# EAGLE design d0reader (EAGLE 9.5.2)
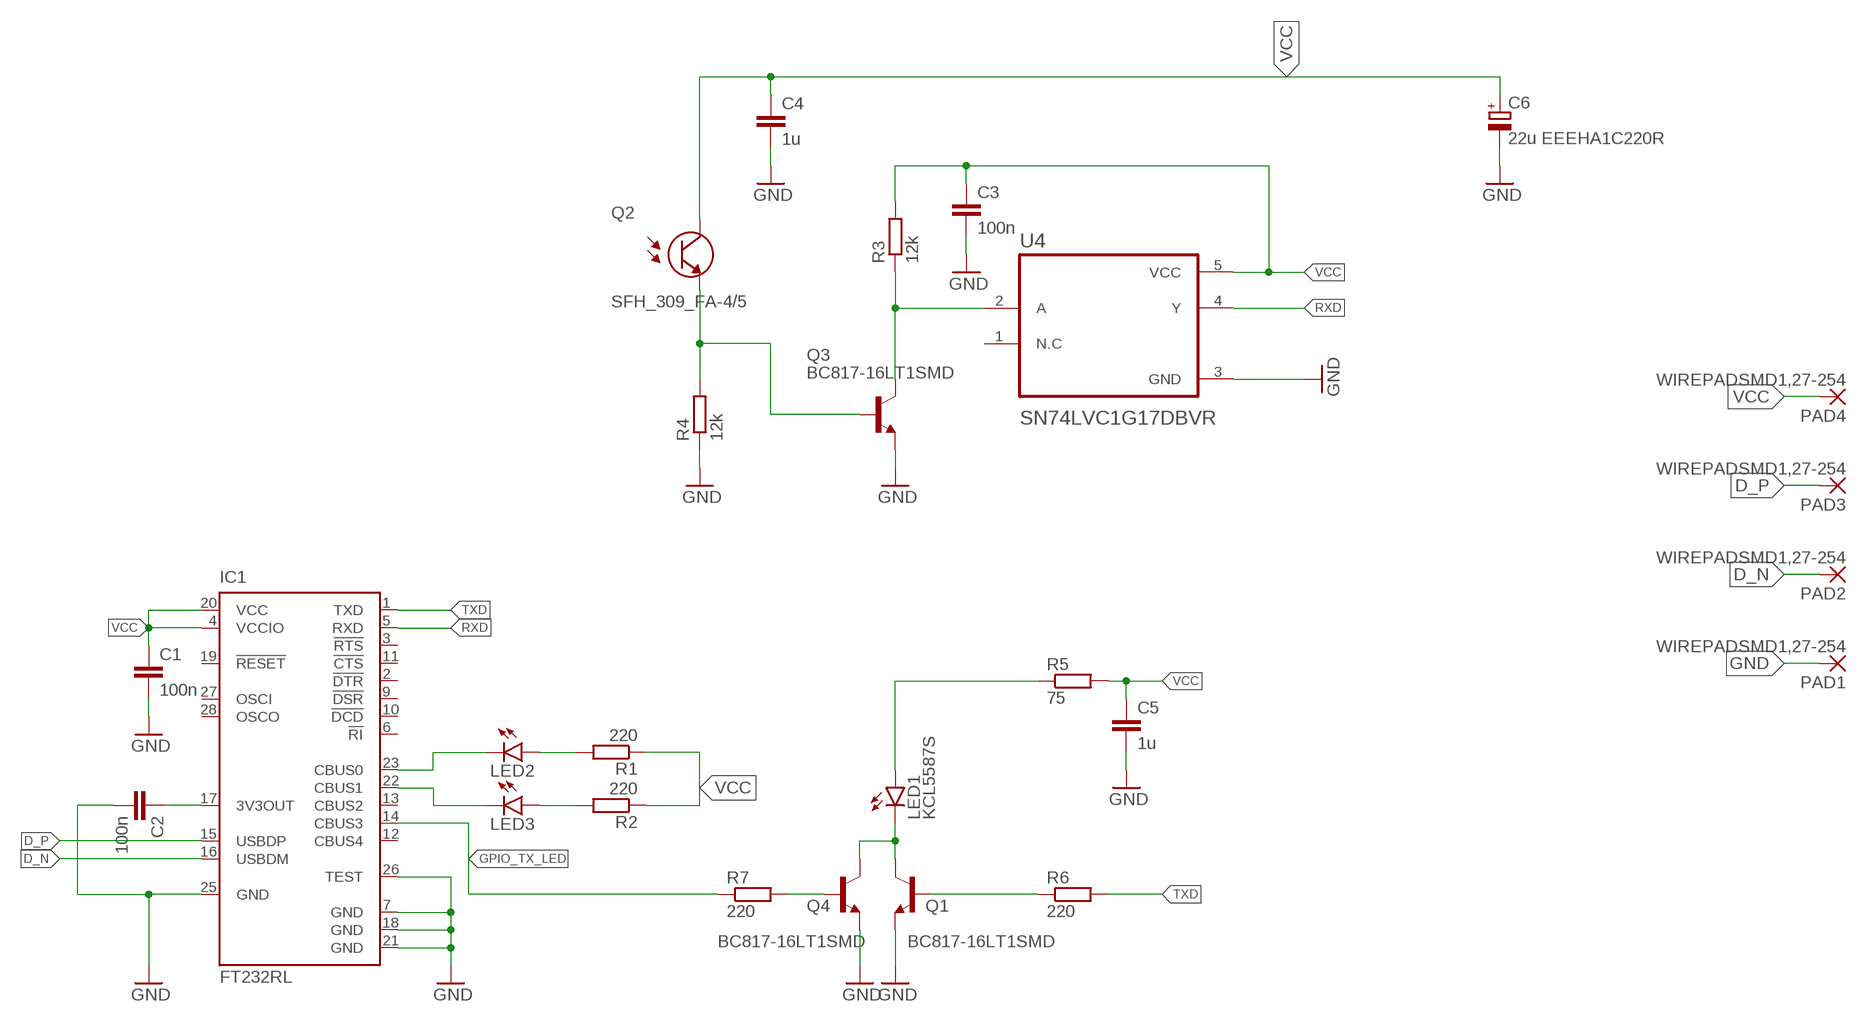
[diagram p0: schematic, sheet 1]

## Parts
C1  100n  C-EUC0805  [C0805]
C2  100n  C-EUC0805  [C0805]
C3  100n  C-EUC0805  [C0805]
C4  1u  C-EUC0805  [C0805]
C5  1u  C-EUC0805  [C0805]
C6  22u EEEHA1C220R  CPOL-EU153CLV-0505  [153CLV-0505]
IC1  FT232RL  [SSOP28]
LED1  KCL5587S  LED5MM  [LED5MM]
LED2  LEDCHIPLED_0805  [CHIPLED_0805]
LED3  LEDCHIPLED_0805  [CHIPLED_0805]
PAD1  WIREPADSMD1,27-254  [SMD1,27-2,54]
PAD2  WIREPADSMD1,27-254  [SMD1,27-2,54]
PAD3  WIREPADSMD1,27-254  [SMD1,27-2,54]
PAD4  WIREPADSMD1,27-254  [SMD1,27-2,54]
Q1  BC817-16LT1SMD  [SOT23-BEC]
Q2  SFH_309_FA-4/5  [XDCR_SFH_309_FA-4/5]
Q3  BC817-16LT1SMD  [SOT23-BEC]
Q4  BC817-16LT1SMD  [SOT23-BEC]
R1  220  R-EU_R0805  [R0805]
R2  220  R-EU_R0805  [R0805]
R3  12k  R-EU_R0805  [R0805]
R4  12k  R-EU_R0805  [R0805]
R5  75  R-EU_R0805  [R0805]
R6  220  R-EU_R0805  [R0805]
R7  220  R-EU_R0805  [R0805]
U4  SN74LVC1G17DBVR  [SOT95P280X145-5N]

## Nets
D_N: IC1.16(USBDM) PAD2.1(P)
D_P: IC1.15(USBDP) PAD3.1(P)
GND: C1.2 C2.2 C3.2 C4.2 C5.2 C6.- IC1.7(GND) IC1.18(GND) IC1.21(GND) IC1.25(GND) IC1.26(TEST) PAD1.1(P) Q1.E Q3.E Q4.E R4.1 U4.3(GND)
GPIO_TX_LED: IC1.14(CBUS3) R7.1
INPUTA: Q3.C R3.1 U4.2(A)
N$9: LED2.A R1.2
N$10: LED3.A R2.2
N$14: C2.1 IC1.17(3V3OUT)
OPTO_RX: Q2.1(E) Q3.B R4.2
RXD: IC1.5(RXD) U4.4(Y)
RXLED: IC1.22(CBUS1) LED3.C
TX_LED_Q1: Q1.B R6.1
TX_LED_Q4: Q4.B R7.2
TXD: IC1.1(TXD) R6.2
TXLED: IC1.23(CBUS0) LED2.C
TXLEDGND: LED1.K(C) Q1.C Q4.C
TXLEDVCC: LED1.A R5.1
VCC: C1.1 C3.1 C4.1 C5.1 C6.+ IC1.4(VCCIO) IC1.20(VCC) PAD4.1(P) Q2.2(C) R1.1 R2.1 R3.2 R5.2 U4.5(VCC)
Unconnected: IC1.2(!DTR) IC1.3(!RTS) IC1.6(!RI) IC1.9(!DSR) IC1.10(!DCD) IC1.11(!CTS) IC1.12(CBUS4) IC1.13(CBUS2) IC1.19(!RESET) IC1.27(OSCI) IC1.28(OSCO) U4.1(N.C)

## Library data of the parts
C1-C5 = rcl:C-EU: CAPACITOR, European symbol; SPICEPREFIX: C
C6 = rcl:CPOL-EU: POLARIZED CAPACITOR, European symbol; SPICEPREFIX: C
IC1 = ftdichip:FT232R: Source: http://www.ftdichip.com/Documents/DataSheets/DS_FT232R_v104.pdf; MPN: FT232RL; OC_FARNELL: 1146032; OC_NEWARK: 91K9918
LED1-LED3 = led:LED: LED OSRAM: - CHIPLED LG R971, LG N971, LY N971, LG Q971, LY Q971, LO R971, LY R971 LH N974, LH R974 LS Q976, LO Q976, LY Q976 LO Q996 - Hyper CHIPLED LW Q18S LB Q993, LB Q99A, LB R99A - SideLED LS A670, LO A670, LY A670, LG A670, LP A670 LB A673, LV A673, LT A673, LW A673 LH A674 LY A675 LS A676, LA A676, LO A676, LY A676, LW A676 LS A679, LY A679, LG A679 - Hyper Micro SIDELED® LS Y876, LA Y876, LO Y876, LY Y876 LT Y87S - SmartLED LW L88C, LW L88S LB L89C, LB L89S, LG L890 LS L89K, LO L89K, LY L89K LS L896, LA L896, LO L896, LY L896 - TOPLED LS T670, LO T670, LY T670, LG T670, LP T670 LSG T670, LSP T670, LSY T670, LOP T670, LYG T670 LG T671, LOG T671, LSG T671 LB T673, LV T673, LT T673, LW T673 LH T674 LS T676, LA T676, LO T676, LY T676, LB T676, LH T676, LSB T676, LW T676 LB T67C, LV T67C, LT T67C, LS T67K, LO T67K, LY T67K, LW E67C LS E67B, LA E67B, LO E67B, LY E67B, LB E67C, LV E67C, LT E67C LW T67C LS T679, LY T679, LG T679 LS T770, LO T770, LY T770, LG T770, LP T770 LB T773, LV T773, LT T773, LW T773 LH T774 LS E675, LA E675, LY E675, LS T675 LS T776, LA T776, LO T776, LY T776, LB T776 LHGB T686 LT T68C, LB T68C - Hyper Mini TOPLED® LB M676 - Mini TOPLED Santana® LG M470 LS M47K, LO M47K, LY M47K Source: http://www.osram.convergy.de LUXEON: - LUMILED® LXK2-PW12-R00, LXK2-PW12-S00, LXK2-PW14-U00, LXK2-PW14-V00 LXK2-PM12-R00, LXK2-PM12-S00, LXK2-PM14-U00 LXK2-PE12-Q00, LXK2-PE12-R00, LXK2-PE12-S00, LXK2-PE14-T00, LXK2-PE14-U00 LXK2-PB12-K00, LXK2-PB12-L00, LXK2-PB12-M00, LXK2-PB14-N00, LXK2-PB14-P00, LXK2-PB14-Q00 LXK2-PR12-L00, LXK2-PR12-M00, LXK2-PR14-Q00, LXK2-PR14-R00 LXK2-PD12-Q00, LXK2-PD12-R00, LXK2-PD12-S00 LXK2-PH12-R00, LXK2-PH12-S00 LXK2-PL12-P00, LXK2-PL12-Q00, LXK2-PL12-R00 Source: www.luxeon.com KINGBRIGHT: KA-3528ASYC Source: www.kingbright.com
PAD1-PAD4 = wirepad:WIREPAD: Wire PAD connect wire on PCB
Q1 Q3 Q4 = transistor-npn:BC817*: NPN Transistor
Q2 = SFH_309_FA-4_5:SFH_309_FA-4/5: Phototransistor IR Chip Silicon 900nm 2-Pin T-1 Check prices <https://pricing.snapeda.com/parts/SFH%20309%20FA-4/5/OSRAM%20Opto/view-part?ref=eda>; AVAILABILITY: In Stock; DESCRIPTION: Phototransistors 900nm Top View Radial, T-1 Lens; MF: OSRAM Opto; MP: SFH 309 FA-4/5; PACKAGE: Radial OSRAM Opto; PRICE: None
R1-R7 = rcl:R-EU_: RESISTOR, European symbol; SPICEPREFIX: R
U4 = SN74LVC1G17DBVR:SN74LVC1G17DBVR: Check prices <https://pricing.snapeda.com/parts/SN74LVC1G17DBVR/Texas%20Instruments/view-part?ref=eda>; AVAILABILITY: In Stock; DESCRIPTION: Single Schmitt-Trigger Buffer 5-SOT-23 -40 to 125; MF: Texas Instruments; MP: SN74LVC1G17DBVR; PACKAGE: SOT-23-5 Texas Instruments; PRICE: None; PURCHASE-URL: https://pricing.snapeda.com/search/part/SN74LVC1G17DBVR/?ref=eda

## Board
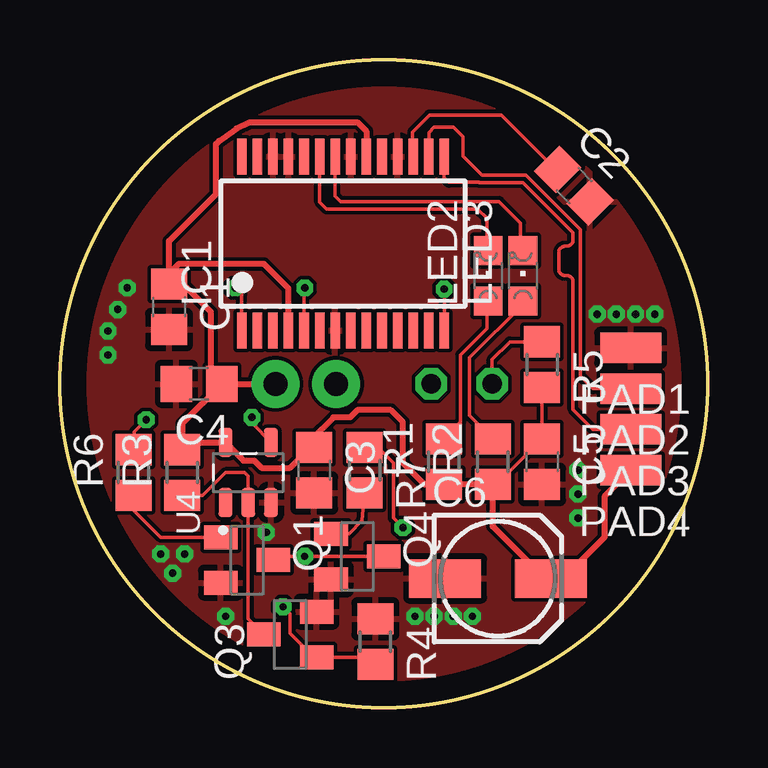
[diagram p1: board, top side]
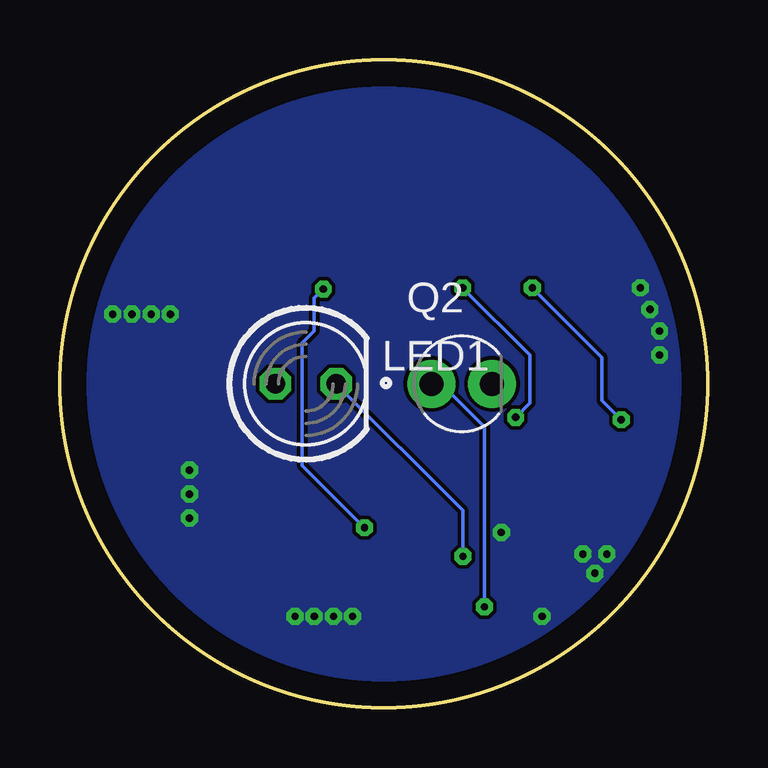
[diagram p2: board, bottom side, seen from below]

Size 27 x 27 mm. Coordinates in mm from the lower left corner, seen from the top.
Outline: circle at 13.5,13.5 radius 13.5
Copper layers (1*16): Top 0.035mm / dielectric 1.5mm / Bottom 0.035mm
Design rules "mme": minimum track width 6mil, minimum drill 0.3mm, track to track 6mil, track to pad 8mil, pad to pad 8mil, via to via 8mil, smd to smd 8mil, copper to edge 40mil, drill to drill 8mil, minimum pad ring 10mil, minimum via ring 8mil, stop-mask expansion 4mil, vias tented up to drill 0mil, thermal gap 10mil

### Footprints (pad centres in the part's own frame; a part is rotated, then mirrored left to right if it is on the bottom)
C0805 = smd 1.3 x 1.5: 1 -0.95,0; 2 0.95,0
153CLV-0505 = smd 3 x 1.6: + 2.2,0; - -2.2,0
SSOP28 = smd 0.4 x 1.5: 1 -4.225,-3.625; 2 -3.575,-3.625; 3 -2.925,-3.625; 4 -2.275,-3.625; 5 -1.625,-3.625; 6 -0.975,-3.625; 7 -0.325,-3.625; 8 0.325,-3.625; 9 0.975,-3.625; 10 1.625,-3.625; 11 2.275,-3.625; 12 2.925,-3.625; 13 3.575,-3.625; 14 4.225,-3.625; 15 4.225,3.625; 16 3.575,3.625; 17 2.925,3.625; 18 2.275,3.625; 19 1.625,3.625; 20 0.975,3.625; 21 0.325,3.625; 22 -0.325,3.625; 23 -0.975,3.625; 24 -1.625,3.625; 25 -2.275,3.625; 26 -2.925,3.625; 27 -3.575,3.625; 28 -4.225,3.625
LED5MM = drill 0.813 octagon: A -1.27,0; K 1.27,0
CHIPLED_0805 = smd 1.2 x 1.2: A 0,-1.05; C 0,1.05
SMD1,27-2,54 = smd 1.27 x 2.54: 1 0,0
SOT23-BEC = smd 1 x 1.4: B -0.95,-1.1; C 0,1.1; E 0.95,-1.1
XDCR_SFH_309_FA-4/5 = drill 1 pad 2: 1 -1.27,0; 2 1.27,0
R0805 = smd 1.3 x 1.5: 1 -0.95,0; 2 0.95,0
SOT95P280X145-5N = smd 1.21 x 0.59: 1 -1.255,0.95; 2 -1.255,0; 3 -1.255,-0.95; 4 1.255,-0.95; 5 1.255,0.95

### Placement (x,y rotation side)
C1  4.55,16.71 270 top
C2  21.43,21.76 315 top
C3  10.6,9.9 270 top
C4  5.8,13.5 180 top
C5  20.1,10.25 270 top
C6  18.26,5.38 0 top
IC1  11.8,19.34 0 top
LED1  16.75,13.5 0 bottom
LED2  17.85,18 0 top
LED3  19.3,18 0 top
PAD1  23.8,15 90 top
PAD2  23.8,13.3 90 top
PAD3  23.8,11.6 90 top
PAD4  23.8,9.9 90 top
Q1  7.8,6.15 270 top
Q2  10.25,13.5 0 bottom
Q3  9.6,3.05 90 top
Q4  12.4,6.3 270 top
R1  16,10.25 90 top
R2  18.05,10.25 90 top
R3  5.1,9.8 90 top
R4  13.15,2.75 270 top
R5  20.1,14.3 270 top
R6  3.07,9.8 90 top
R7  12.7,9.9 270 top
U4  7.85,9.8 90 top

### Tracks (layer width: path | path; a pad name or v marks a point on that pad's centre or on a via)
D_N
  Top 0.152: PAD2.1 22.23,13.3 21.7,13.82 21.7,19.93 19.43,22.2 17.6,22.2 16.8,23 16.8,23.8 16.4,24.2 15.6,24.2 15.38,23.98 IC1.16
D_P
  Top 0.152: PAD3.1 22.23,11.6 21.39,12.43 21.39,17.75 arc90 21.13,18.01 21.06,18.01 arc-90 20.79,18.28 20.79,18.97 arc-90 21.06,19.23 21.13,19.23 arc90 21.39,19.5 21.39,19.8 19.3,21.89 17.47,21.89 17.47,21.9 16.2,21.9 16,22.1 16,22.94 IC1.15
GND  (via drill 0.3)
  other vias: 24.8,16.4 24,16.4 23.2,16.4 22.4,16.4 17.2,3.8 16.4,3.8 15.6,3.8 14.8,3.8 21.6,9.9 21.6,8.9 21.6,7.9 8.6,7.3 4.2,6.4 5.2,6.4 4.7,5.6 6.9,3.8 2.8,17.5 2.4,16.6 2,15.7 2,14.7
  pour Bottom: 0,0 26.1,0 arc90 27.1,1 27.1,26.8 arc90 26.7,27.2 6.5,27.2 1,27.2 arc90 0,26.2
  pour Top: 0,0 0,26.1 arc-90 1,27.1 26.8,27.1 arc-90 27.2,26.7 27.2,6.5 27.2,1 arc-90 26.2,0
GPIO_TX_LED  (via drill 0.3)
  Top 0.152: IC1.14 v16.02,17.45 | v14.3,7.5 13.9,7.9 13.9,10.2 13.25,10.85 R7.1
  Bottom 0.152: v16.02,17.45 16.4,17.07 16.4,15.7 16.9,15.2 16.9,10.1 v14.3,7.5
INPUTA
  Top 0.152: R3.1 5.95,8.85 6.9,9.8 7.7,9.8 7.85,9.65 U4.2 7.85,3.7 Q3.C
N$9
  Top 0.152: LED2.A 17.8,16.9 17.8,15.8 16.7,14.7 16.7,11.9 R1.2
N$10
  Top 0.152: R2.2 17.08,12.17 17.08,14.59 19.3,16.8 LED3.A
N$14
  Top 0.152: C2.1 20.67,22.43 18.4,24.7 15.4,24.7 14.7,24 14.7,22.99 IC1.17
OPTO_RX  (via drill 0.3)
  Top 0.152: R4.2 12.85,2.1 Q3.B 10.6,2.1 9.6,3.1 9.6,3.9 v9.3,4.2
  Bottom 0.152: Q2.1 11.1,13.5 9.3,11.71 v9.3,4.2
RXD  (via drill 0.3)
  Top 0.152: IC1.5 10.18,17.47 v10.21,17.5 | v8,12.1 8,11.86 U4.4
  Bottom 0.152: v10.21,17.5 7.4,14.69 7.4,12.7 v8,12.1
RXLED
  Top 0.152: LED3.C 19.2,19.15 19.2,20.2 18.3,21.09 11.71,21.09 11.47,21.32 IC1.22
TX_LED_Q1
  Top 0.152: R6.1 3.1,8.2 4.2,7.1 Q1.B
TX_LED_Q4
  Top 0.152: Q4.B 12.05,7.25 12.6,7.8 R7.2
TXD  (via drill 0.3)
  Top 0.152: IC1.1 7.58,17.23 v7.3,17.5 | v3.6,12 3.1,11.5 R6.2
  Bottom 0.152: v7.3,17.5 4.4,14.6 4.4,12.8 v3.6,12
TXLED
  Top 0.152: IC1.23 10.82,21.07 11.11,20.79 17.41,20.79 17.8,20.4 17.8,19.1 LED2.C
TXLEDGND  (via drill 0.3)
  Top 0.152: Q1.C 9.05,6.3 v10.2,6.3 Q4.C
  Bottom 0.152: LED1.K 10.2,8.22 v10.2,6.3
TXLEDVCC
  Top 0.152: LED1.A 18.02,14.52 18.75,15.25 R5.1
VCC
  Top 0.152: R5.2 C5.1 18.2,9.3 R2.1
  Top 0.254: PAD4.1 22.7,8.8 22.7,7.1 20.98,5.38 C6.+ 20.22,5.38 18.05,7.55 R2.1 R1.1 15.2,9.3 14.3,10.2 14.3,11.9 13.8,12.4 12.4,12.4 12.1,12.1 11.4,12.1 10.45,11.15 10.45,10.85 | C4.1 5.1,11.85 R3.2 5.41,11.05 U4.5 7.66,10.3 8.1,10.3 8.4,10 9.6,10 10.45,10.85 | C4.1 Q2.2 | C4.1 6.3,13.95 6.3,16.5 5.14,17.66 C1.1 4.55,18.1 | 4.55,18.1 4.55,19.45 6.5,21.4 6.5,23.5 6.62,23.62 7.36,24.14 7.93,24.4 12.4,24.4 12.78,24.02 IC1.20 | IC1.4 9.53,17.48 8.5,18.5 4.95,18.5 4.55,18.1 | 10.45,10.85 C3.1